# Altium schematic sheet CH1-Isolation.SchDoc: CH1 ISOLATION
size A4; Author: MOG; CompanyName: GIE GROUP; DrawnBy: MOG; Organization: Gie SA; Address1: Galicia 52; Address2: Mar del Plata; Address3: Buenos Aires; Address4: Argentina; DocumentNumber: 3; Revision: 0.0; SheetNumber: 3; SheetTotal: 14; Project: CP DATALOGGER; PageSetup: Record=PageOptions|CenterHorizontal=True|CenterVertical=True|PrintScale=0.94|XCorrection=1.00|YCorrection=1.00|PrintKind=0|BorderSize=5000000|LeftOffset=0|BottomOffset=0|Orientation=2|PaperLength=1000|PaperWidth=1000|Scale=100|PaperSource=7|PrintQuality=720|MediaType=1|DitherType=10|PaperKind=A4|PrintScaleMode=1
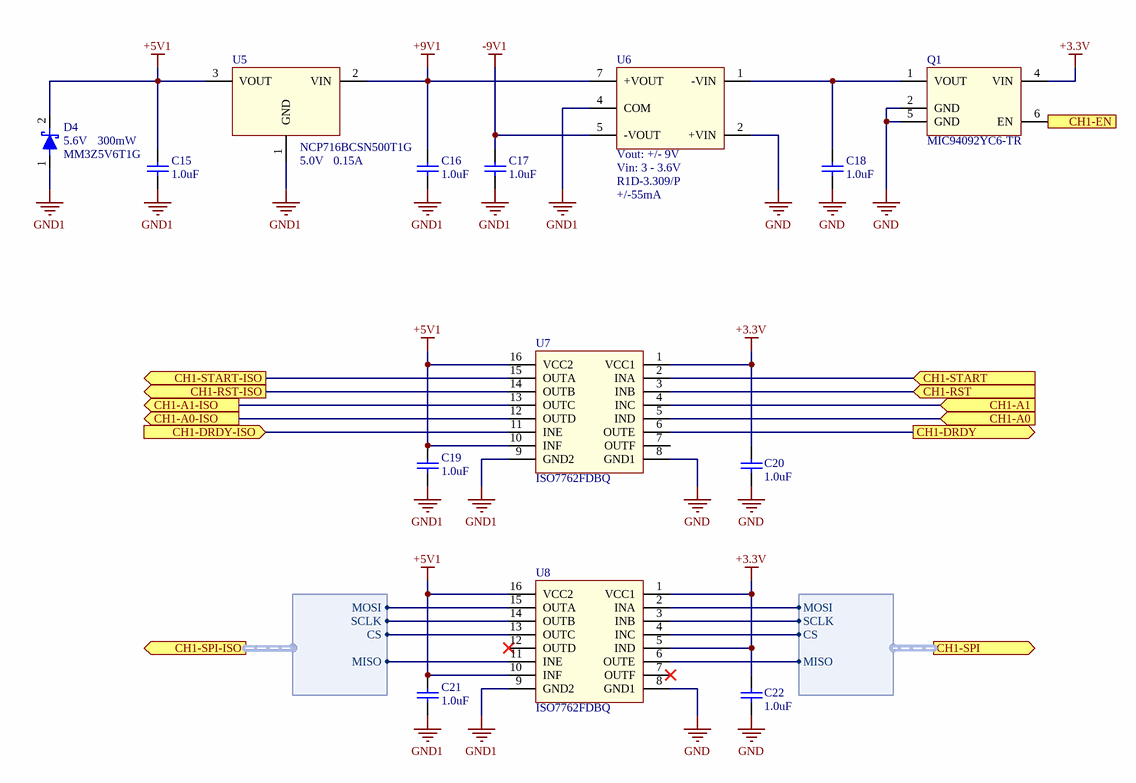
[diagram p0: CH1-Isolation.SchDoc]

## Parts
C15  value 1.0uF  [CAP-0603]  (hidden comment: C0603C105M3RAC7867)
C16  value 1.0uF  [CAP-0603]  (hidden comment: C0603C105M3RAC7867)
C17  value 1.0uF  [CAP-0603]  (hidden comment: C0603C105M3RAC7867)
C18  value 1.0uF  [CAP-0603]  (hidden comment: C0603C105M3RAC7867)
C19  value 1.0uF  [CAP-0603]  (hidden comment: C0603C105M3RAC7867)
C20  value 1.0uF  [CAP-0603]  (hidden comment: C0603C105M3RAC7867)
C21  value 1.0uF  [CAP-0603]  (hidden comment: C0603C105M3RAC7867)
C22  value 1.0uF  [CAP-0603]  (hidden comment: C0603C105M3RAC7867)
D4  Power: 300mW  Vz: 5.6V  [SOD323 - DIODE UNIDIR]  (hidden comment: MM3Z5V6T1G)
Q1  MIC94092YC6-TR  [TSSOP6]
U5  Voltage: 5.0V  Current: 0.15A  [SOT23-5]  (hidden comment: NCP716BCSN500T1G)
U6  Vout: +/- 9V  Vin: 3 - 3.6V  Current: +/-55mA  [RECOM-R1D]  (hidden comment: R1D-3.309/P)
U7  ISO7762FDBQ  [SSOP16]
U8  ISO7762FDBQ  [SSOP16]

## Ports
CH1-A0 (in), CH1-A0-ISO (out), CH1-A1 (in), CH1-A1-ISO (out), CH1-DRDY (out), CH1-DRDY-ISO (in), CH1-EN (in), CH1-RST (in), CH1-RST-ISO (out), CH1-SPI (out, harness CH1-SPI), CH1-SPI-ISO (out, harness CH1-SPI-ISO), CH1-START (in), CH1-START-ISO (out)

## Harnesses
CH1-SPI-ISO: MOSI, MISO, SCLK, CS
CH1-SPI: MOSI, MISO, SCLK, CS

## Nets
+3.3V: C20.2 C22.2 Q1.4(VIN) U7.1(VCC1) U8.1(VCC1) U8.5(IND)
+5V1: C15.2 C19.2 C21.2 D4.2(K) U5.3(VOUT) U7.10(INF) U7.16(VCC2) U8.10(INF) U8.16(VCC2)
+9V1: C16.2 U5.2(VIN) U6.7(+VOUT)
-9V1: C17.2 U6.5(-VOUT)
GND: C18.1 C20.1 C22.1 Q1.2(GND) Q1.5(GND) U6.2(+VIN) U7.8(GND1) U8.8(GND1)
GND1: C15.1 C16.1 C17.1 C19.1 C21.1 D4.1(A) U5.1(GND) U6.4(COM) U7.9(GND2) U8.9(GND2)
CH1-A0: U7.5(IND) ; port CH1-A0
CH1-A0-ISO: U7.12(OUTD) ; port CH1-A0-ISO
CH1-A1: U7.4(INC) ; port CH1-A1
CH1-A1-ISO: U7.13(OUTC) ; port CH1-A1-ISO
CH1-DRDY: U7.6(OUTE) ; port CH1-DRDY
CH1-DRDY-ISO: U7.11(INE) ; port CH1-DRDY-ISO
CH1-EN: Q1.6(EN) ; port CH1-EN
CH1-RST: U7.3(INB) ; port CH1-RST
CH1-RST-ISO: U7.14(OUTB) ; port CH1-RST-ISO
CH1-START: U7.2(INA) ; port CH1-START
CH1-START-ISO: U7.15(OUTA) ; port CH1-START-ISO
NetC18_2: C18.2 Q1.1(VOUT) U6.1(-VIN)
NetU8_2: U8.2(INA) ; port CH1-SPI.MOSI
NetU8_3: U8.3(INB) ; port CH1-SPI.SCLK
NetU8_4: U8.4(INC) ; port CH1-SPI.CS
NetU8_6: U8.6(OUTE) ; port CH1-SPI.MISO
NetU8_11: U8.11(INE) ; port CH1-SPI-ISO.MISO
NetU8_13: U8.13(OUTC) ; port CH1-SPI-ISO.CS
NetU8_14: U8.14(OUTB) ; port CH1-SPI-ISO.SCLK
NetU8_15: U8.15(OUTA) ; port CH1-SPI-ISO.MOSI

Not connected (* = marked no-connect by the designer): U7 7(OUTF); U8 7(OUTF)* 12(OUTD)*

## Notes on the sheet
- PROYECTO:
- Rev:
- NOMBRE:
- FECHA:
- REALIZO:
- REVISO:
- APROBO:
- PAG:
- HOJA:
- DE
- A4

## Library data of the parts
C15-C22 = C0603C105M3RAC7867: CAP CER 1uF 25V X7R 0603; Manufacturer: Kemet; Tolerance: 20%; Voltage: 25; PartNumber: C0603C105M3RAC7867; Supplier 1: Digi-Key; Supplier 2: Mouser; Supplier Part Number 1: 399-C0603C105M3RAC7867CT-ND; Supplier Part Number 2: 80-C0603C105M3R
D4 = MM3Z5V6T1G: Schottky Diode 30V 200mA SOT323; Manufacturer: OnSemiconductor; PartNumber: MM3Z5V6T1G
Q1 = MIC94092YC6-TR: Manufacturer: Microchip; PartNUmber: MIC94092YC6-TR
U5 = NCP716BCSN500T1G: IC REG LDO 0.5V 0.15A TSOT23-5; Manufacturer: ON Semiconductor; PartNumber: NCP716BCSN500T1G
U6 = R1D-3.309/P: DC DC CONVERTER +/-9V 1W; Manufacturer: Recom; Supplier 1: Digi-Key; Supplier 2: Mouser; Supplier Part Number 1: R1D-3.309/P-ND; Supplier Part Number 2: 919-R1D-3.309P; Part Number: R1D-3.309/P
U7 U8 = ISO7762FDBQ: Digital Isolator, six-channel, 4/2, 16-SSOP; Manufacturer: Texas Instruments; Supplier 1: Digi-Key; Supplier 2: Mouser; Supplier Part Number 1: 296-49452-6-ND; Supplier Part Number 2: 595-ISO7762FDBQR; PartNumber: ISO7762FDBQ